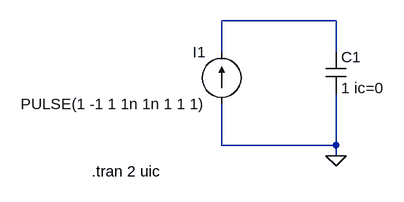
[diagram p0: schematic g4_p1.asc]
g4_p1.asc, the LTspice schematic file:
Version 4
SHEET 1 880 680
WIRE 208 80 32 80
WIRE 32 128 32 80
WIRE 208 128 208 80
WIRE 32 272 32 208
WIRE 208 272 208 192
WIRE 208 272 32 272
WIRE 208 288 208 272
FLAG 208 288 0
SYMBOL cap 192 128 R0
SYMATTR InstName C1
SYMATTR Value 1 ic=0
SYMBOL current 32 208 R180
WINDOW 0 24 80 Left 2
WINDOW 3 24 0 Left 2
WINDOW 123 0 0 Left 0
WINDOW 39 0 0 Left 0
SYMATTR InstName I1
SYMATTR Value PULSE(1 -1 1 1n 1n 1 1 1)
TEXT -168 312 Left 2 !.tran 2 uic

The netlist it stands for:
* g4_p1.asc
C1 N001 0 1 ic=0
I1 0 N001 PULSE(1 -1 1 1n 1n 1 1 1)
.tran 2 uic
.backanno
.end